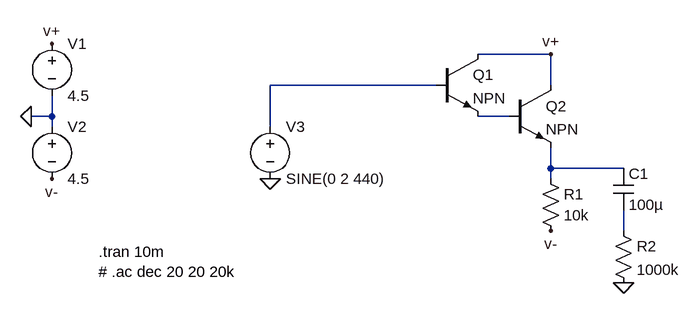
[diagram p0: schematic output-buffer.asc]
output-buffer.asc, the LTspice schematic file:
Version 4
SHEET 1 880 680
WIRE 592 176 480 176
WIRE 416 224 160 224
WIRE 592 224 592 176
WIRE -176 272 -176 240
WIRE -176 272 -208 272
WIRE 528 272 480 272
WIRE -176 288 -176 272
WIRE 160 288 160 224
WIRE 592 352 592 320
WIRE 704 352 592 352
WIRE 592 368 592 352
WIRE 704 448 704 416
FLAG -208 272 0
FLAG -176 160 v+
FLAG -176 368 v-
FLAG 160 368 0
FLAG 592 176 v+
FLAG 592 448 v-
FLAG 704 528 0
SYMBOL voltage -176 144 R0
SYMATTR InstName V1
SYMATTR Value 4.5
SYMBOL voltage -176 272 R0
SYMATTR InstName V2
SYMATTR Value 4.5
SYMBOL voltage 160 272 R0
SYMATTR InstName V3
SYMATTR Value SINE(0 2 440)
SYMATTR Value2 AC 2
SYMBOL npn 416 176 R0
SYMATTR InstName Q1
SYMBOL npn 528 224 R0
SYMATTR InstName Q2
SYMBOL res 576 352 R0
WINDOW 3 36 72 Left 2
SYMATTR InstName R1
SYMATTR Value 10k
SYMBOL cap 688 352 R0
SYMATTR InstName C1
SYMATTR Value 100µ
SYMBOL res 688 432 R0
SYMATTR InstName R2
SYMATTR Value 1000k
TEXT -104 480 Left 2 !.tran 10m\n# .ac dec 20 20 20k

The netlist it stands for:
* output-buffer.asc
V1 v+ 0 4.5
V2 0 v- 4.5
V3 N001 0 SINE(0 2 440) AC 2
Q1 v+ N001 N002 0 NPN
Q2 v+ N002 N003 0 NPN
R1 N003 v- 10k
C1 N003 N004 100µ
R2 N004 0 1000k
.model NPN NPN
.model PNP PNP
.lib standard.bjt
.tran 10m
# .ac dec 20 20 20k
.backanno
.end